# Altium project PCB_Project1.PrjPCB
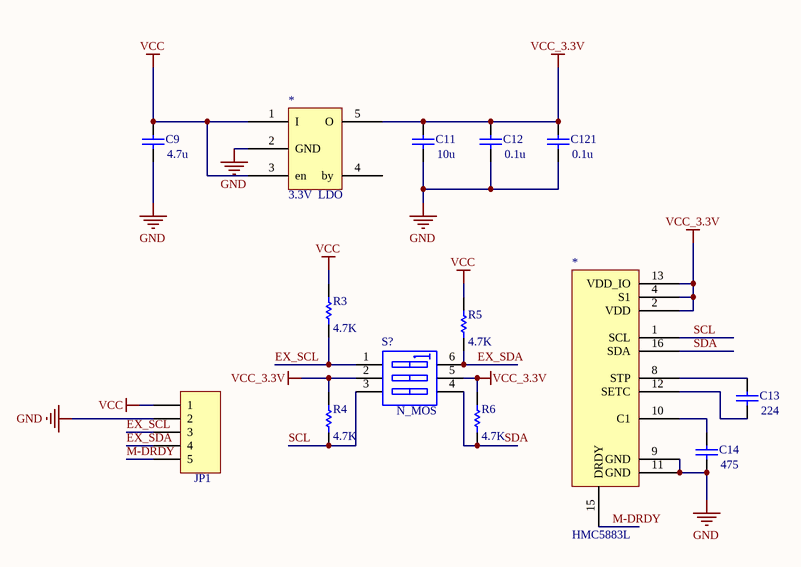
[diagram p0: Sheet1.SchDoc]
1 sheet, 14 parts. Net scope: global (net labels, ports and power ports of the same name join across sheets).
Board file: PCB1.PcbDoc

## Sheet Sheet1.SchDoc
size A4

### Parts
C9  value 4.7u  [1608[0603]]  (hidden comment: Cap)
C11  value 10u  [3.2X1.6X1.1]  (hidden comment: Cap)
C12  value 0.1u  [1608[0603]]  (hidden comment: Cap)
C13  value 224  [6-0805_N]  (hidden comment: Cap)
C14  value 475  [6-0805_N]  (hidden comment: Cap)
C121  value 0.1u  [1608[0603]]  (hidden comment: Cap)
Q1  N_MOS  [SOT23-6_M]
Q2  HMC5883L  [HMC5883L]
Q3  3.3V  LDO  [SOT23-5_M]
R3  value 4.7K  [1608[0603]]  (hidden comment: Res1)
R4  value 4.7K  [1608[0603]]  (hidden comment: Res1)
R5  value 4.7K  [1608[0603]]  (hidden comment: Res1)
R6  value 4.7K  [1608[0603]]  (hidden comment: Res1)
  JP1  [HDR1X5]

### Nets
GND: C9.1 C11.1 C12.1 C14.1 C121.1 Q2.9(GND) Q2.11(GND) Q3.2(GND) .2
VCC: C9.2 Q3.1(I) Q3.3(en) R3.2 R5.2 .1
VCC_3.3V: C11.2 C12.2 C121.2 Q1.2(A2) Q1.5(B2) Q2.2(VDD) Q2.4(S1) Q2.13(VDD_IO) Q3.5(O) R4.2 R6.2
EX_SCL: Q1.1(A1) R3.1 .3
EX_SDA: Q1.6(B1) R5.1 .4
M-DRDY: Q2.15(DRDY) .5
SCL: Q1.3(A3) Q2.1(SCL) R4.1
SDA: Q1.4(B3) Q2.16(SDA) R6.1
NetC13_1: C13.1 Q2.12(SETC)
NetC13_2: C13.2 Q2.8(STP)
NetC14_2: C14.2 Q2.10(C1)

Not connected (* = marked no-connect by the designer): Q3 4(by)

### Library data of the parts
C9 C11-C14 C121 = Cap: Capacitor; Published: 8-Jun-2000; LatestRevisionDate: 17-Jul-2002; LatestRevisionNote: Re-released for DXP Platform.; PackageReference: RAD-0.3; Publisher: Altium Limited; PackageDescription: Radial Cap, Thru-Hole; 2 Leads; 0.3 in Pin Spacing
Q1 = SW DIP-3: DIP Switch, 3 Position, SPST
R3-R6 = Res1: Resistor; Published: 8-Jun-2000; LatestRevisionDate: 17-Jul-2002; LatestRevisionNote: Re-released for DXP Platform.; PackageReference: AXIAL-0.3; Publisher: Altium Limited; PackageDescription: Axial Device, Thru-Hole; 2 Leads; 0.3 in Pin Spacing
 = Header 5: Header, 5-Pin